# Altium schematic sheet Sensors_Board.SchDoc
size A4
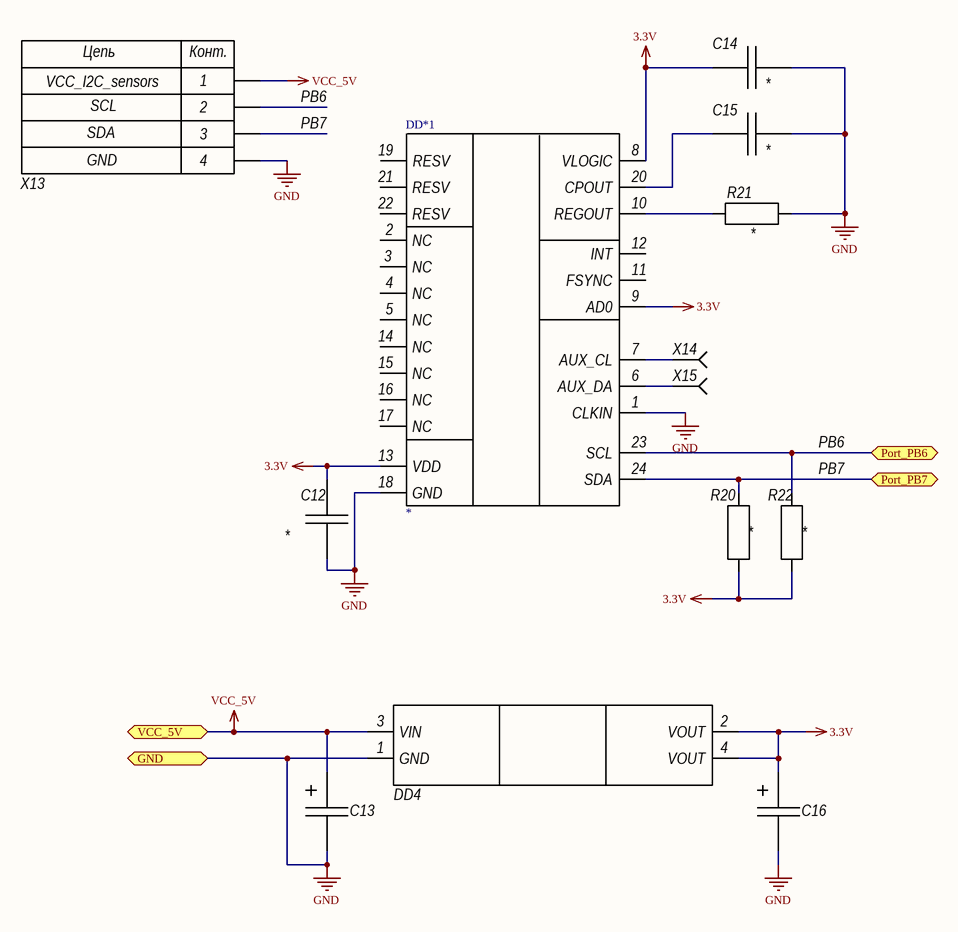
[diagram p0: Sensors_Board.SchDoc]

## Parts
C12  *  [CAP EIA 0805]
C13  Cap El Case A (Tantalum)  [CAP CASE A]  (value not drawn)
C14  *  [CAP EIA 0805]
C15  *  [CAP EIA 0805]
C16  Cap El Case A (Tantalum)  [CAP CASE A]  (value not drawn)
DD4  LM1117S50  [SOT-223_M]  (value not drawn)
DD*1  *  [(MPU60-x0)QNF24 4*4*0.9]
R20  *  [RES EIA 0805]
R21  *  [RES EIA 0805]
R22  *  [RES EIA 0805]
X13  (no value)  [SWD]
X14  *  [Pin - Referal]  (value not drawn)  (no BOM)
X15  *  [Pin - Referal]  (value not drawn)  (no BOM)

## Ports
GND, Port_PB6, Port_PB7, VCC_5V

## Nets
3.3V: C12.1 C14.1 C16.1 DD4.2(VOUT) DD4.4(VOUT) DD*1.8(VLOGIC) DD*1.9(AD0) DD*1.13(VDD) R20.2 R22.1
GND: C12.2 C13.2 C14.2 C15.2 C16.2 DD4.1(GND) DD*1.1(CLKIN) DD*1.18(GND) R21.1 X13.4 ; port GND
VCC_5V: C13.1 DD4.3(VIN) X13.1 ; port VCC_5V
PB6: DD*1.23(SCL) R22.2 X13.2 ; port Port_PB6
PB7: DD*1.24(SDA) R20.1 X13.3 ; port Port_PB7
NetC15_1: C15.1 DD*1.20(CPOUT)
NetDD*1_6: DD*1.6(AUX_DA) X15.1
NetDD*1_7: DD*1.7(AUX_CL) X14.1
NetDD*1_10: DD*1.10(REGOUT) R21.2

Not connected (* = marked no-connect by the designer): DD*1 2(NC) 3(NC) 4(NC) 5(NC) 11(FSYNC) 12(INT) 14(NC) 15(NC) 16(NC) 17(NC) 19(RESV) 21(RESV) 22(RESV)

## Notes on the sheet
- VCC_I2C_sensors
- SDA
- SCL
- GND
- (in symbol PLS-4) Цепь; Конт.

## Library data of the parts
C12 C14 C15 = Cap EIA 0805: Group: Конденсаторы; Manufacturer: *; Name: *; Value: *; Supplier: *
C13 C16 = Cap El Case A (Tantalum): Group: Конденсаторы; Manufacturer: *; Name: *; Value: *; Supplier: *
DD4 = LM1117S50: LDO Voltage Regulator; Manufacturer: ST Microelectronics; Group: Микросхемы; Value: Регулятор напряжения LDO 800mA; Name: LM1117S50; Supplier: ООО "Торгэлектроника"
DD*1 = MPU6050: MPU-60X0 is the device that combines a 3-axis  gyroscope, 3-axis accelerometer
R20-R22 = Res EIA 0805: Group: Резисторы; Manufacturer: *; Name: *; Value: *; Supplier: *
X13 = PLS-4: Manufacturer: Hsuan Mao(Китай); Group: Разъемы; Value: Разъем штыревой четырехконтактный; Name: PLS-4; Supplier: ООО"Торгэлектроника"
X14 X15 = Pin_Referal: Generic Pin Contact; Value: Generic Pin Contact Referal; Group: -; Manufacturer: -; Name: -; Supplier: -